# EAGLE design bot_uc_board (EAGLE 9.6.2)
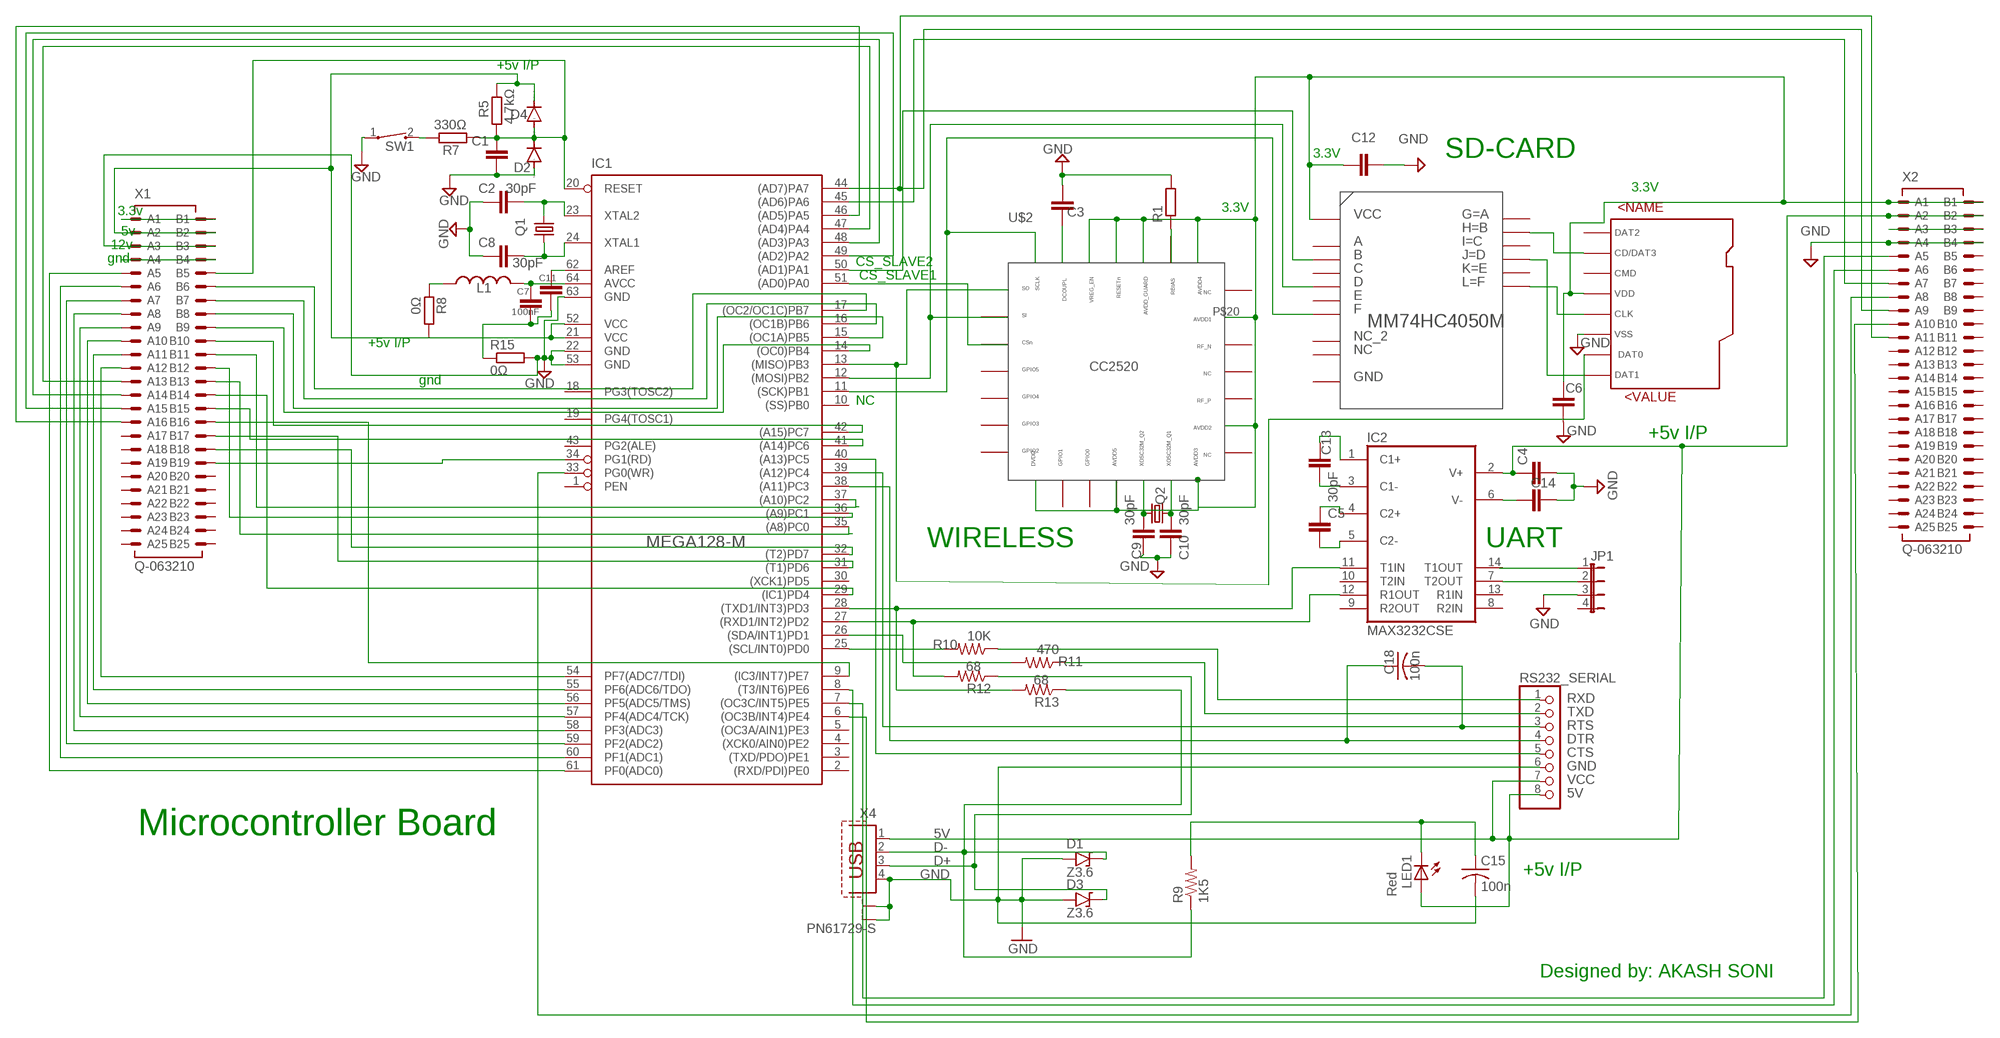
[diagram p0: schematic, sheet 1]

## Parts
C1  C-EU025-024X044  [C025-024X044]
C2  30pF  C-EU025-024X044  [C025-024X044]
C3  C-EU025-024X044  [C025-024X044]
C4  C-EU025-024X044  [C025-024X044]
C5  C-EU025-024X044  [C025-024X044]
C6  30pF  C-EU025-024X044  [C025-024X044]
C7  C-EU025-024X044  [C025-024X044]
C8  30pF  C-EU025-024X044  [C025-024X044]
C9  30pF  C-EU025-024X044  [C025-024X044]
C10  30pF  C-EU025-024X044  [C025-024X044]
C11  100nF  C-EU025-024X044  [C025-024X044]
C12  C-EU025-024X044  [C025-024X044]
C13  30pF  C-EU025-024X044  [C025-024X044]
C14  C-EU025-024X044  [C025-024X044]
C15  100n  C-US050-024X044  [C050-024X044]
C18  100n  C-US050-024X044  [C050-024X044]
D1  Z3.6  1N9ZENER  [DO35-3]
D2  1N4004  [DO41-10]
D3  Z3.6  1N9ZENER  [DO35-3]
D4  1N4004  [DO41-10]
IC1  MEGA128-M  [MLF64]
IC2  MAX3232CSE  [SO16]
JP1  JP4E  [JP4]
L1  L-US0204/5  [0204/5]
LED1  Red  LED3MM  [LED3MM]
Q1  CRYSTALHC49U-V  [HC49U-V]
Q2  CRYSTALHC49U-V  [HC49U-V]
R1  R-EU_0204/2V  [0204V]
R5  4.7kΩ  R-EU_0204/2V  [0204V]
R7  330Ω  R-EU_0204/2V  [0204V]
R8  0Ω  R-EU_0204/2V  [0204V]
R9  1K5  R-US_0207/7  [0207/7]
R10  10K  R-US_0207/7  [0207/7]
R11  470  R-US_0207/7  [0207/7]
R12  68  R-US_0207/7  [0207/7]
R13  68  R-US_0207/7  [0207/7]
R15  0Ω  R-EU_0204/2V  [0204V]
RS232_SERIAL  PINHD-1X8/90  [1X08/90]
SW1  CT10-XXXX-A2  [CT10-XXXX-A2]
U$1  74HC4050  [74HC405]
U$2  CC2520  [CC2520_FOOT]
U$3  SDCARD  [SDCARD_FOOT]
X1  Q-063210  [063210]
X2  Q-063210  [063210]
X4  PN61729-S  [PN61729-S]

## Nets
3.3V_VCC: D4.C IC1.21(VCC) IC1.52(VCC) R5.2 R8.2
D+: D3.C R12.1 X4.3
D-: D1.C R9.1 R13.1 X4.2
GND: C1.1 C2.1 C3.1 C4.2 C6.1 C8.1 C9.1 C10.1 C12.2 C14.2 C15.2 D1.A D2.A D3.A IC1.22(GND) IC1.53(GND) IC1.63(GND) JP1.3 R1.2 R15.2 RS232_SERIAL.6 SW1.1 U$3.P$6(VSS) X1.A3 X1.B3 X2.A4 X2.B4 X4.4 X4.S1 X4.S2
N$1: D2.C D4.A IC1.20(RESET) R5.1 R7.1 X1.B5
N$2: IC1.12((MOSI)PB2) U$1.P$9(D) U$2.P$2
N$3: C7.1 IC1.64(AVCC) L1.1
N$4: L1.2 R8.1
N$5: IC1.51((AD0)PA0) U$2.P$3
N$6: R7.2 SW1.2
N$7: IC1.13((MISO)PB3) U$2.P$1 U$3.P$7(DAT0)
N$8: C2.2 IC1.23(XTAL2) Q1.2
N$9: C8.2 IC1.24(XTAL1) Q1.1
N$10: C9.2 Q2.2 U$2.P$12
N$11: C10.2 Q2.1 U$2.P$13
N$12: IC1.11((SCK)PB1) U$1.P$14(F) U$2.P$28
N$13: C11.2 IC1.62(AREF)
N$14: C7.2 C11.1 R15.1
N$15: R1.1 U$2.P$23
N$16: C3.2 U$2.P$27
N$17: U$1.P$4(H) U$3.P$2(CD/DAT3)
N$18: C6.2 C12.1 U$1.P$1(VCC) U$2.P$8 U$2.P$11 U$2.P$14 U$2.P$16 U$2.P$20 U$2.P$22 U$2.P$24 U$2.P$25 U$2.P$26 U$3.P$4(VDD) X2.A1 X2.B1
N$19: U$1.P$10(J) U$3.P$8(DAT1)
N$20: U$1.P$15(L) U$3.P$5(CLK)
N$21: IC1.50((AD1)PA1) U$1.P$5(B)
N$22: X1.A2 X1.B2
N$23: C4.1 IC2.2(V+) LED1.A RS232_SERIAL.7 RS232_SERIAL.8 X2.A2 X2.B2 X4.1
N$24: C14.1 IC2.6(V-)
N$25: C5.1 IC2.4(C2+)
N$26: C13.1 IC2.1(C1+)
N$27: C5.2 IC2.5(C2-)
N$28: C13.2 IC2.3(C1-)
N$29: IC2.14(T1OUT) JP1.1
N$30: IC2.7(T2OUT) JP1.2
N$31: C15.1 LED1.K(C) R9.2
N$32: IC1.61(PF0(ADC0)) X1.A5
N$33: IC1.60(PF1(ADC1)) X1.A6
N$34: C18.1 IC1.38((A11)PC3) RS232_SERIAL.4
N$35: C18.2 IC1.39((A12)PC4) RS232_SERIAL.3
N$36: IC1.40((A13)PC5) RS232_SERIAL.5
N$37: IC1.25((SCL/INT0)PD0) R10.2
N$38: IC1.26((SDA/INT1)PD1) R11.2
N$39: IC1.27((RXD1/INT2)PD2) IC2.12(R1OUT) R12.2
N$40: IC1.28((TXD1/INT3)PD3) IC2.11(T1IN) R13.2
N$41: IC1.59(PF2(ADC2)) X1.A7
N$42: IC1.58(PF3(ADC3)) X1.A8
N$43: IC1.57(PF4(ADC4/TCK)) X1.A9
N$44: IC1.56(PF5(ADC5/TMS)) X1.A10
N$45: IC1.55(PF6(ADC6/TDO)) X1.A11
N$46: IC1.54(PF7(ADC7/TDI)) X1.A12
N$47: IC1.47((AD4)PA4) X1.A13
N$48: IC1.48((AD3)PA3) X1.A14
N$49: IC1.49((AD2)PA2) X1.A15
N$50: IC1.46((AD5)PA5) X1.A16
N$51: X1.A1 X1.B1
N$52: X1.A4 X1.B4
N$53: IC1.31((T1)PD6) X1.B17
N$54: IC1.32((T2)PD7) X1.B18
N$55: IC1.34(PG1(RD)) X1.B19
N$56: IC1.9((IC3/INT7)PE7) X1.B16
N$57: IC1.17((OC2/OC1C)PB7) X1.B6
N$58: IC1.16((OC1B)PB6) X1.B7
N$59: IC1.15((OC1A)PB5) X1.B8
N$60: IC1.14((OC0)PB4) X1.B9
N$61: IC1.42((A15)PC7) X1.B10
N$62: IC1.41((A14)PC6) X1.B15
N$63: IC1.37((A10)PC2) X1.B11
N$64: IC1.36((A9)PC1) X1.B12
N$65: IC1.35((A8)PC0) X1.B13
N$66: IC1.29((IC1)PD4) X1.B14
N$67: X2.A3 X2.B3
N$68: IC1.7((OC3C/INT5)PE5) X2.A5
N$69: IC1.8((T3/INT6)PE6) X2.A6
N$70: IC1.45((AD6)PA6) X2.A7
N$71: IC1.33(PG0(WR)) X2.A8
N$72: IC1.44((AD7)PA7) X2.A9 X2.A11
N$73: IC1.6((OC3B/INT4)PE4) X2.A10
RXD: R10.1 RS232_SERIAL.1
TXD: R11.1 RS232_SERIAL.2
Unconnected: C1.2 IC1.1(PEN) IC1.2((RXD/PDI)PE0) IC1.3((TXD/PDO)PE1) IC1.4((XCK0/AIN0)PE2) IC1.5((OC3A/AIN1)PE3) IC1.10((SS)PB0) IC1.18(PG3(TOSC2)) IC1.19(PG4(TOSC1)) IC1.30((XCK1)PD5) IC1.43(PG2(ALE)) IC2.8(R2IN) IC2.9(R2OUT) IC2.10(T2IN) IC2.13(R1IN) JP1.4 U$1.P$2(G) U$1.P$3(A) U$1.P$6(I) U$1.P$7(C) U$1.P$8(GND) U$1.P$11(E) U$1.P$12(K) U$1.P$13(NC_2) U$1.P$16(NC) U$2.P$4 U$2.P$5 U$2.P$6 U$2.P$7 U$2.P$9 U$2.P$10 U$2.P$15 U$2.P$17 U$2.P$18 U$2.P$19 U$2.P$21 U$3.P$1(DAT2) U$3.P$3(CMD) X1.A17 X1.A18 X1.A19 X1.A20 X1.A21 X1.A22 X1.A23 X1.A24 X1.A25 X1.B20 X1.B21 X1.B22 X1.B23 X1.B24 X1.B25 X2.A12 X2.A13 X2.A14 X2.A15 X2.A16 X2.A17 X2.A18 X2.A19 X2.A20 X2.A21 X2.A22 X2.A23 X2.A24 X2.A25 X2.B5 X2.B6 X2.B7 X2.B8 X2.B9 X2.B10 X2.B11 X2.B12 X2.B13 X2.B14 X2.B15 X2.B16 X2.B17 X2.B18 X2.B19 X2.B20 X2.B21 X2.B22 X2.B23 X2.B24 X2.B25

## Notes on the sheet
- +5v I/P
- 3.3V | SD-CARD
- 3.3V
- 3.3v | 3.3V
- 5v
- 12v
- gnd | CS_SLAVE2
- CS_SLAVE1
- +5v I/P
- gnd
- NC
- +5v I/P
- WIRELESS | UART
- RXD
- TXD
- RTS
- DTR
- CTS
- GND
- VCC
- 5V
- Microcontroller Board | 5V
- +5v I/P
- Designed by: AKASH SONI

## Power pins joined to a net without a drawn wire
3.3V_VCC: IC2.16(VCC)
GND: IC2.15(GND)

## Library data of the parts
C1-C14 = rcl:C-EU: CAPACITOR, European symbol; SPICEPREFIX: C
C15 C18 = adafruit:C-US: CAPACITOR, American symbol
D1 D3 = gm-diodes:1N9*ZENER: 1N9???B Zener Diode DO-35 case 1N957B - 1N992B (6.8V to 200V)
D2 D4 = diode:1N4004: DIODE general purpose rectifier, 1 A
IC1 = atmel:MEGA128: MICROCONTROLLER 128 Kbytes FLASH 4 Kbytes SRAM 4 Kbytes EEPROM DUAL USART 8-channel 10 bit ADC Source: avr.lbr; MPN: ATMEGA128-16MU; OC_FARNELL: 1455093; OC_NEWARK: 58M3717
IC2 = maxim:MAX3232*: True RS-232 Transceivers 3.0V to 5.5V, Low-Power up to 1Mbps, Using Four 0.1µF External Capacitors Source: http://pdfserv.maxim-ic.com/en/ds/MAX3222-MAX3241.pdf; MPN: MAX3232CSE; OC_FARNELL: 9725490; OC_NEWARK: 90C2890
JP1 = jumper:JP4E: JUMPER
L1 = rcl:L-US: INDUCTOR, American symbol; SPICEPREFIX: L
LED1 = adafruit:LED: LED OSRAM: - CHIPLED LG R971, LG N971, LY N971, LG Q971, LY Q971, LO R971, LY R971 LH N974, LH R974 LS Q976, LO Q976, LY Q976 LO Q996 - Hyper CHIPLED LW Q18S LB Q993, LB Q99A, LB R99A - SideLED LS A670, LO A670, LY A670, LG A670, LP A670 LB A673, LV A673, LT A673, LW A673 LH A674 LY A675 LS A676, LA A676, LO A676, LY A676, LW A676 LS A679, LY A679, LG A679 - Hyper Micro SIDELED® LS Y876, LA Y876, LO Y876, LY Y876 LT Y87S - SmartLED LW L88C, LW L88S LB L89C, LB L89S, LG L890 LS L89K, LO L89K, LY L89K LS L896, LA L896, LO L896, LY L896 - TOPLED LS T670, LO T670, LY T670, LG T670, LP T670 LSG T670, LSP T670, LSY T670, LOP T670, LYG T670 LG T671, LOG T671, LSG T671 LB T673, LV T673, LT T673, LW T673 LH T674 LS T676, LA T676, LO T676, LY T676, LB T676, LH T676, LSB T676, LW T676 LB T67C, LV T67C, LT T67C, LS T67K, LO T67K, LY T67K, LW E67C LS E67B, LA E67B, LO E67B, LY E67B, LB E67C, LV E67C, LT E67C LW T67C LS T679, LY T679, LG T679 LS T770, LO T770, LY T770, LG T770, LP T770 LB T773, LV T773, LT T773, LW T773 LH T774 LS E675, LA E675, LY E675, LS T675 LS T776, LA T776, LO T776, LY T776, LB T776 LHGB T686 LT T68C, LB T68C - Hyper Mini TOPLED® LB M676 - Mini TOPLED Santana® LG M470 LS M47K, LO M47K, LY M47K Source: http://www.osram.convergy.de/
Q1 Q2 = crystal:CRYSTAL: CRYSTAL; OC_FARNELL: 1666969; OC_NEWARK: unknown
R1 R5 R7 R8 R15 = rcl:R-EU_: RESISTOR, European symbol; SPICEPREFIX: R
R9-R13 = adafruit:R-US_: RESISTOR, American symbol
RS232_SERIAL = pinhead:PINHD-1X8: PIN HEADER
SW1 = switch-coto:CT10-XXXX-: CT10 Series Molded Switch Source: www.cotorelay.com .. Coto_Technology__CT10-1530-G1.pdf
U$1 = 74HC4050:74HC4050
U$2 = CC2520_wireless_module:CC2520
U$3 = SDCard:SDCARD
X1 X2 = con-erni:Q-063210: Male Connector SMC-Q 50 contacts Standard Assembly Height Source: http://www.erni.com/DB/PDF-Drawing/SMC/063210.pdf; OC_FARNELL: unknown; OC_NEWARK: unknown
X4 = con-berg:PN61729-S: BERG USB connector; OC_FARNELL: unknown; OC_NEWARK: unknown

## Board
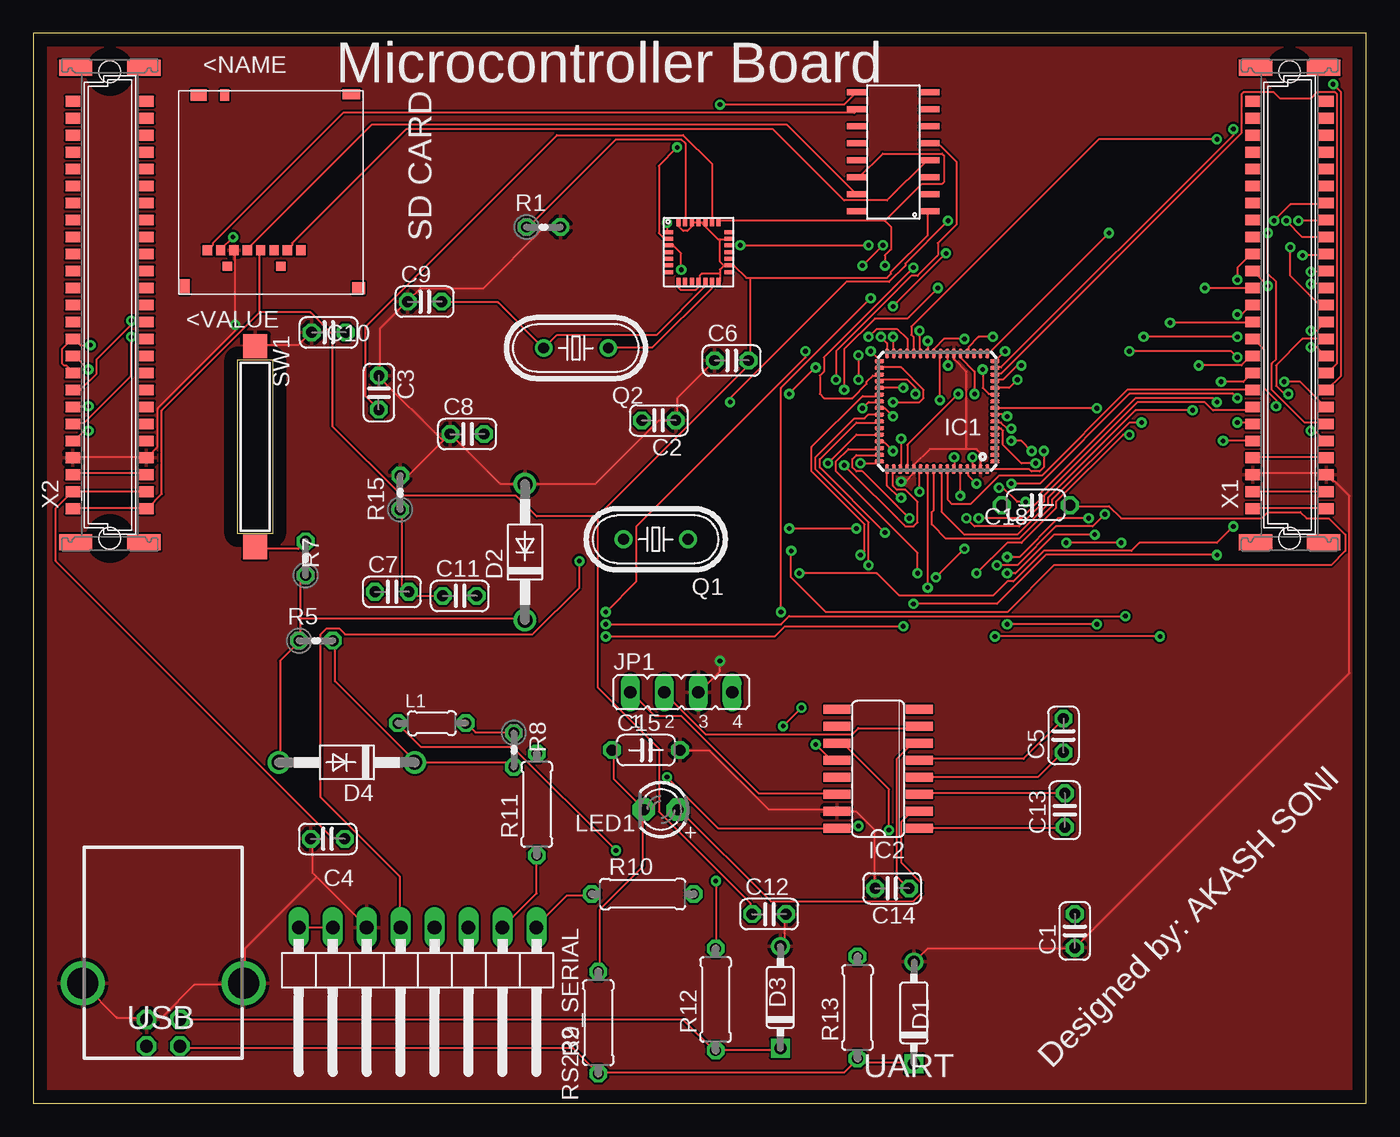
[diagram p1: board, top side]
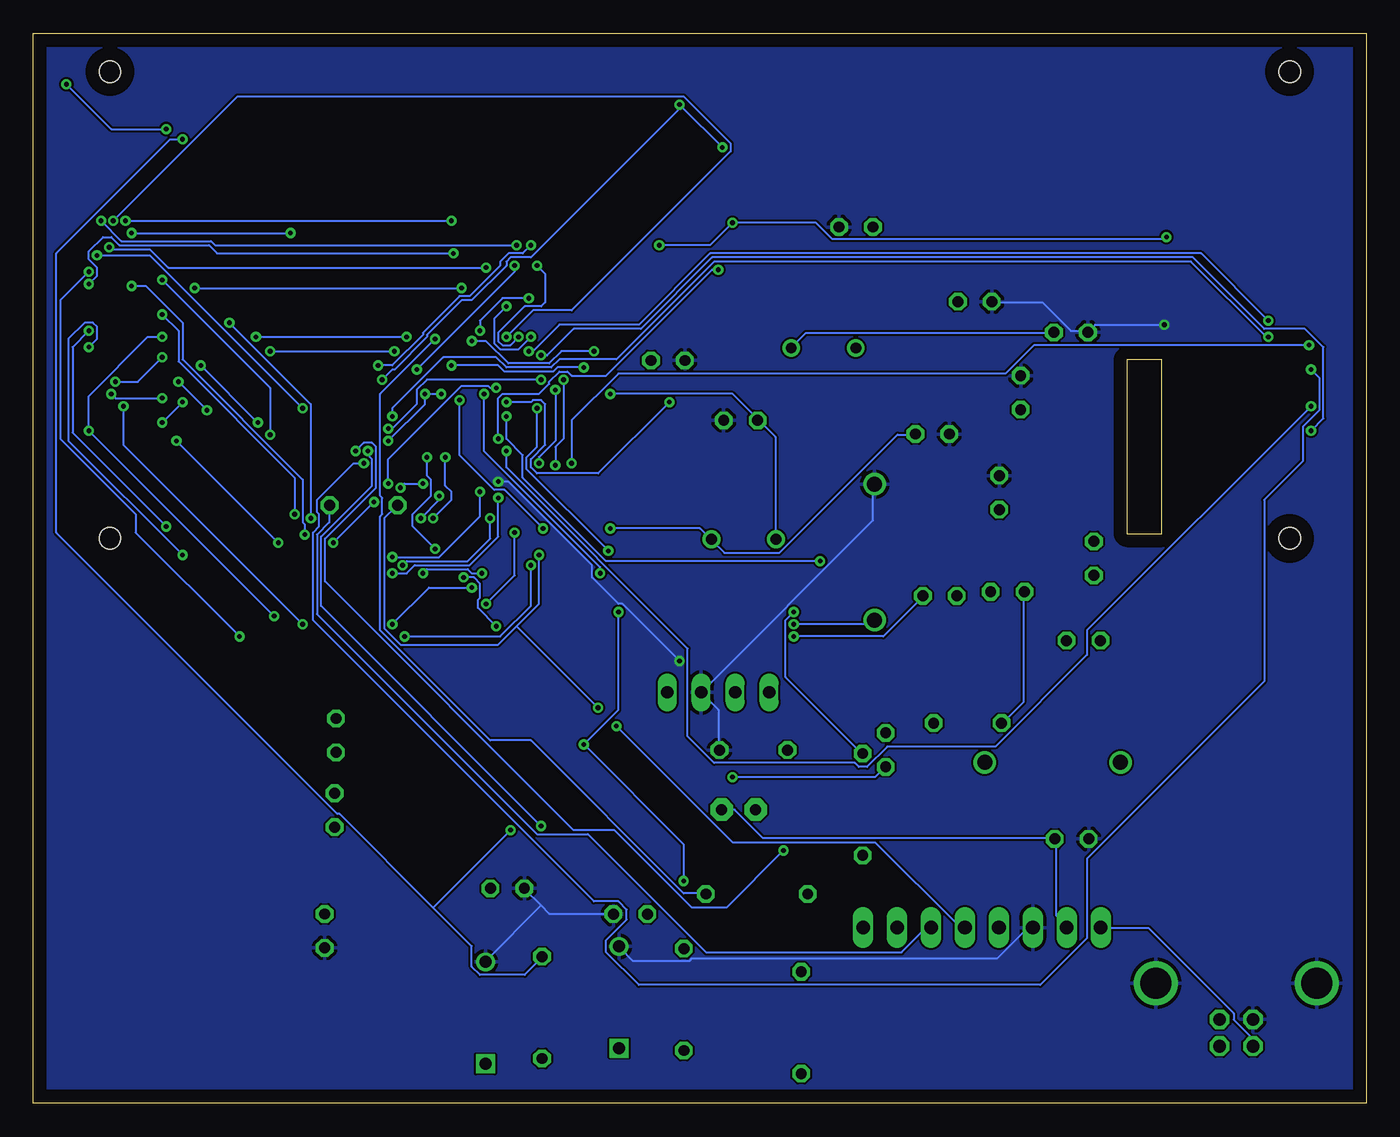
[diagram p2: board, bottom side, seen from below]

Size 99.7 x 80 mm. Coordinates in mm from the lower left corner, seen from the top.
Outline: 0,0 99.7,0 99.7,80 0,80 0,0
Copper layers (1*16): Top 0.035mm / dielectric 1.5mm / Bottom 0.035mm
Design rules "default": minimum track width 6mil, minimum drill 0.35mm, track to track 6mil, track to pad 6mil, pad to pad 6mil, via to via 6mil, smd to smd 6mil, copper to edge 40mil, drill to drill 6mil, minimum pad ring 10mil, minimum via ring 8mil, stop-mask expansion 4mil, vias tented up to drill 0mil, thermal gap 10mil

### Footprints (pad centres in the part's own frame; a part is rotated, then mirrored left to right if it is on the bottom)
C025-024X044 = drill 0.813 octagon: 1 -1.27,0; 2 1.27,0
C050-024X044 = drill 0.813 octagon: 1 -2.54,0; 2 2.54,0
DO35-3 = drill 0.9: A 3.81,0 | drill 0.9 square: C -3.81,0
DO41-10 = drill 1.118: A 5.08,0; C -5.08,0
MLF64 = smd 0.7 x 0.3: 1 -4.325,3.75; 2 -4.325,3.25; 3 -4.325,2.75; 4 -4.325,2.25; 5 -4.325,1.75; 6 -4.325,1.25; 7 -4.325,0.75; 8 -4.325,0.25; 9 -4.325,-0.25; 10 -4.325,-0.75; 11 -4.325,-1.25; 12 -4.325,-1.75; 13 -4.325,-2.25; 14 -4.325,-2.75; 15 -4.325,-3.25; 16 -4.325,-3.75; 33 4.325,-3.75; 34 4.325,-3.25; 35 4.325,-2.75; 36 4.325,-2.25; 37 4.325,-1.75; 38 4.325,-1.25; 39 4.325,-0.75; 40 4.325,-0.25; 41 4.325,0.25; 42 4.325,0.75; 43 4.325,1.25; 44 4.325,1.75; 45 4.325,2.25; 46 4.325,2.75; 47 4.325,3.25; 48 4.325,3.75 | smd 0.3 x 0.7: 17 -3.75,-4.325; 18 -3.25,-4.325; 19 -2.75,-4.325; 20 -2.25,-4.325; 21 -1.75,-4.325; 22 -1.25,-4.325; 23 -0.75,-4.325; 24 -0.25,-4.325; 25 0.25,-4.325; 26 0.75,-4.325; 27 1.25,-4.325; 28 1.75,-4.325; 29 2.25,-4.325; 30 2.75,-4.325; 31 3.25,-4.325; 32 3.75,-4.325; 49 3.75,4.325; 50 3.25,4.325; 51 2.75,4.325; 52 2.25,4.325; 53 1.75,4.325; 54 1.25,4.325; 55 0.75,4.325; 56 0.25,4.325; 57 -0.25,4.325; 58 -0.75,4.325; 59 -1.25,4.325; 60 -1.75,4.325; 61 -2.25,4.325; 62 -2.75,4.325; 63 -3.25,4.325; 64 -3.75,4.325
SO16 = smd 0.66 x 2.032: 1 -4.445,-3.073; 2 -3.175,-3.073; 3 -1.905,-3.073; 4 -0.635,-3.073; 5 0.635,-3.073; 6 1.905,-3.073; 7 3.175,-3.073; 8 4.445,-3.073; 9 4.445,3.073; 10 3.175,3.073; 11 1.905,3.073; 12 0.635,3.073; 13 -0.635,3.073; 14 -1.905,3.073; 15 -3.175,3.073; 16 -4.445,3.073
JP4 = drill 0.914 long: 1 -3.81,0; 2 -1.27,0; 3 1.27,0; 4 3.81,0
0204/5 = drill 0.813 octagon: 1 -2.54,0; 2 2.54,0
LED3MM = drill 0.813 pad 1.676 octagon: A -1.27,0; K 1.27,0
HC49U-V = drill 0.813: 1 -2.413,0; 2 2.413,0
0204V = drill 0.813 octagon: 1 -1.27,0; 2 1.27,0
0207/7 = drill 0.813 octagon: 1 -3.81,0; 2 3.81,0
1X08/90 = drill 1.016 long: 1 -8.89,-3.81; 2 -6.35,-3.81; 3 -3.81,-3.81; 4 -1.27,-3.81; 5 1.27,-3.81; 6 3.81,-3.81; 7 6.35,-3.81; 8 8.89,-3.81
CT10-XXXX-A2 = smd 1.8 x 1.8: 1 -7.5,0; 2 7.5,0
74HC405 = smd 1.5 x 0.45: P$1 -0.75,9.44; P$2 -0.75,8.17; P$3 -0.75,6.9; P$4 -0.75,5.63; P$5 -0.75,4.36; P$6 -0.75,3.09; P$7 -0.75,1.82; P$8 -0.75,0.55; P$9 4.65,0.55; P$10 4.65,1.82; P$11 4.65,3.09; P$12 4.65,4.36; P$13 4.65,5.63; P$14 4.65,6.9; P$15 4.65,8.17; P$16 4.65,9.44
CC2520_FOOT = smd 0.65 x 0.3: P$1 0.325,4.075; P$2 0.325,3.575; P$3 0.325,3.075; P$4 0.325,2.575; P$5 0.325,2.075; P$6 0.325,1.575; P$7 0.325,1.075; P$15 4.825,1.075; P$16 4.825,1.575; P$17 4.825,2.075; P$18 4.825,2.575; P$19 4.825,3.075; P$20 4.825,3.575; P$21 4.825,4.075 | smd 0.3 x 0.65: P$8 1.075,0.325; P$9 1.575,0.325; P$10 2.075,0.325; P$11 2.575,0.325; P$12 3.075,0.325; P$13 3.575,0.325; P$14 4.075,0.325; P$22 1.075,4.825; P$23 1.575,4.825; P$24 2.075,4.825; P$25 2.575,4.825; P$26 3.075,4.825; P$27 3.575,4.825; P$28 4.075,4.825
SDCARD_FOOT = smd 0.7 x 0.65: GND 0.725,2.075; GND1 -3.275,2.075 | smd 0.7 x 0.75: P$1 2.225,3.275; P$2 1.225,3.275; P$3 0.225,3.275; P$4 -0.775,3.275; P$5 -1.775,3.275; P$6 -2.775,3.275; P$7 -3.775,3.275; P$8 -4.775,3.275 | smd 0.95 x 0.9: P$11 6.55,0.45 | smd 0.745 x 1.1: P$12 -6.46,0.55 | smd 0.65 x 0.85: P$13 -3.475,14.875 | smd 1.3 x 0.75: P$14 6.013,14.925 | smd 1.2 x 0.85: P$16 -5.412,14.875
063210 = smd 0.8 x 1.1: A1 -15.24,2.765; A2 -13.97,2.765; A3 -12.7,2.765; A4 -11.43,2.765; A5 -10.16,2.765; A6 -8.89,2.765; A7 -7.62,2.765; A8 -6.35,2.765; A9 -5.08,2.765; A10 -3.81,2.765; A11 -2.54,2.765; A12 -1.27,2.765; A13 0,2.765; A14 1.27,2.765; A15 2.54,2.765; A16 3.81,2.765; A17 5.08,2.765; A18 6.35,2.765; A19 7.62,2.765; A20 8.89,2.765; A21 10.16,2.765; A22 11.43,2.765; A23 12.7,2.765; A24 13.97,2.765; A25 15.24,2.765; B1 -15.24,-2.74; B2 -13.97,-2.74; B3 -12.7,-2.74; B4 -11.43,-2.74; B5 -10.16,-2.74; B6 -8.89,-2.74; B7 -7.62,-2.74; B8 -6.35,-2.74; B9 -5.08,-2.74; B10 -3.81,-2.74; B11 -2.54,-2.74; B12 -1.27,-2.74; B13 0,-2.74; B14 1.27,-2.74; B15 2.54,-2.74; B16 3.81,-2.74; B17 5.08,-2.74; B18 6.35,-2.74; B19 7.62,-2.74; B20 8.89,-2.74; B21 10.16,-2.74; B22 11.43,-2.74; B23 12.7,-2.74; B24 13.97,-2.74; B25 15.24,-2.74 | smd 1.2 x 2.5: M1 -17.745,2.55; M2 -17.745,-2.55; M3 17.745,-2.55; M4 17.745,2.55 | hole 1.6: -17.45,0; 17.45,0
PN61729-S = drill 0.95 octagon: 1 1.25,4.71; 2 -1.25,4.71; 3 -1.25,2.71; 4 1.25,2.71 | drill 2.3 pad 2.9: S1 -6.02,0; S2 6.02,0

### Placement (x,y rotation side)
C1  77.91,12.88 90 top
C2  46.79,51.06 180 top
C3  25.84,53.14 270 top
C4  22.02,19.76 180 top
C5  77.06,27.5 90 top
C6  52.23,55.54 0 top
C7  26.82,38.24 0 top
C8  32.45,50.04 0 top
C9  29.27,59.94 0 top
C10  22.09,57.64 0 top
C11  31.89,37.94 0 top
C12  55.04,14.14 0 top
C13  77.16,21.91 90 top
C14  64.24,16.06 180 top
C15  45.83,26.4 0 top
C18  75,44.72 0 top
D1  65.88,6.75 90 top
D2  36.77,41.21 90 top
D3  55.88,7.91 90 top
D4  23.45,25.48 180 top
IC1  67.61,51.74 180 top
IC2  63.2,25.01 90 top
JP1  48.47,30.72 0 top
L1  29.81,28.42 0 top
LED1  46.94,21.95 180 top
Q1  46.56,42.17 180 top
Q2  40.59,56.47 180 top
R1  38.16,65.52 0 top
R5  21.14,34.59 0 top
R7  20.36,40.74 90 top
R8  35.94,26.42 270 top
R9  42.26,6.02 90 top
R10  45.58,15.64 0 top
R11  37.66,22.34 90 top
R12  51.04,7.75 90 top
R13  61.65,7.15 90 top
R15  27.44,45.66 90 top
RS232_SERIAL  28.74,9.32 180 top
SW1  16.59,49.09 270 top
U$1  66.28,76.14 180 top
U$2  47.19,61.07 0 top
U$3  17.78,60.51 0 top
X1  93.98,59.69 90 top
X2  5.71,59.69 90 top
X4  9.71,8.97 180 top

### Tracks (layer width: path | path; a pad name or v marks a point on that pad's centre or on a via)
3.3V_VCC  (via drill 0.35)
  Top 0.152: R5.2 22.55,34.44 22.55,31.55 28.5,25.6 D4.C 28.65,25.45 35.66,25.45 35.81,25.3 R8.2 | v69.19,53.03 65.38,49.23 65.38,47.55 IC1.52 | v70.41,53.03 70.41,54.71 69.34,55.78 69.34,55.93 IC1.21 | v47.4,24.38 51.21,20.57 60.05,20.57 IC2.16 60.2,20.57 60.35,20.73 v61.72,20.73 | v73.15,49.53 73.91,49.53 v74.68,48.77
  Bottom 0.152: v69.19,53.03 v70.41,53.03 70.41,52.27 v73.15,49.53 | v47.4,24.38 36.73,24.38 35.97,25.15 R8.2 | v74.68,48.77 74.68,48.46 74.37,48.16 74.37,46.18 78.18,42.37 78.18,37.19 v61.72,20.73
D+
  Top 0.152: D3.C 55.78,3.96 51.05,3.96 R12.1 50.9,3.96 48.62,6.25 10.97,6.25 X4.3
D-
  Top 0.152: D1.C 65.84,3.05 61.87,3.05 61.72,3.2 R13.1 61.57,3.2 60.66,2.29 42.37,2.29 R9.1 42.22,2.29 40.39,4.12 10.97,4.12 X4.2
GND  (via drill 0.35)
  Top 0.152: C6.1 50.9,55.47 48.16,52.73 48.16,51.21 C2.1 48.01,51.05 46.79,51.05 42.06,46.33 36.88,46.33 D2.A 36.73,46.33 34.9,46.33 31.24,49.99 C8.1 31.09,49.99 30.63,49.53 | 30.63,49.53 28.04,46.94 27.58,46.94 R15.2 | U$3.P$6 15.09,63.7 v15.09,58.22 15.09,57.76 9.3,51.97 9.3,49.07 8.53,48.31 X2.B4 8.38,48.31 3.05,48.31 X2.A4 | SW1.1 16.61,56.69 19.81,56.69 20.73,57.61 C10.1 | R1.2 39.32,65.38 38.1,65.38 33.68,60.96 28.96,60.96 28.04,60.05 C9.1 27.89,59.89 25.91,57.91 25.91,54.56 C3.1 25.76,54.41 30.63,49.53 | X1.A3 91.29,47.09 96.62,47.09 X1.B3 96.77,46.94 97.23,46.48 97.38,46.48 98.45,45.41 98.45,32.16 78.03,11.73 C1.1 77.88,11.58 66.9,11.58 65.99,10.67 D1.A | X4.S2 3.81,8.84 6.25,6.4 8.38,6.4 X4.4 8.53,6.4 9.6,6.4 12.04,8.84 15.7,8.84 X4.S1 15.85,8.99 15.85,11.58 21.18,16.92 | 21.18,16.92 24.84,13.26 RS232_SERIAL.6 | 21.18,16.92 20.88,17.22 20.88,19.66 C4.2 | 69.8,48.92 70.56,48.92 70.87,48.62 70.87,47.55 IC1.63 | 69.8,48.92 67.06,48.92 65.84,47.7 65.84,47.55 IC1.53 65.84,47.4 65.84,47.09 65.23,46.48 v64.92,46.48 | 69.8,48.92 69.8,54.71 68.89,55.63 68.89,55.93 IC1.22 | C12.2 56.24,14.02 56.24,12.04 55.93,11.73 D3.A | C14.2 62.94,16.15 62.94,20.42 61.57,21.79 60.2,21.79 IC2.15 60.05,21.95 55.02,21.95 50.6,26.36 48.46,26.36 C15.2 | v51.36,33.07 51.36,32.31 49.84,30.79 JP1.3
  Bottom 0.152: C9.1 27.89,59.89 24.23,59.89 22.1,57.76 20.88,57.76 C10.1 20.73,57.76 20.27,58.22 v15.09,58.22 | C15.2 48.46,26.52 48.46,29.41 49.68,30.63 JP1.3 49.68,30.79 36.88,43.59 36.88,46.18 D2.A | 61.72,14.78 62.94,16 C14.2 | 61.72,14.78 61.11,14.17 56.39,14.17 C12.2 | v64.92,46.48 64.16,46.48 57.91,40.23 57.91,39.32 55.93,37.34 55.63,37.34 v51.36,33.07 | RS232_SERIAL.6 24.99,13.11 25.3,13.11 27.58,10.82 50.44,10.82 50.6,10.67 54.86,10.67 55.78,11.58 D3.A | 61.72,14.78 65.84,10.67 D1.A
  pour Top: -0.64,80.64 -0.64,-0.64 100.33,-0.64 100.33,80.64
  pour Bottom: -1.27,81.28 -1.27,-1.27 100.97,-1.27 100.97,81.28
N$1  (via drill 0.35)
  Top 0.152: v71.78,57.3 70.71,57.3 69.95,56.54 69.95,56.08 IC1.20 | v90.07,57.3 v83.06,57.3 | v95.56,50.29 95.86,50.29 96.62,49.53 X1.B5 | 19.96,36.27 19.96,39.01 20.27,39.32 R7.1 | 19.96,36.27 19.96,34.59 R5.1 19.81,34.44 18.44,33.07 18.44,25.6 D4.A | 19.96,36.27 36.73,36.27 D2.C | v81.69,36.42 56.54,36.42 55.93,35.81 v42.82,35.81
  Bottom 0.152: v83.06,57.3 v71.78,57.3 | v90.07,57.3 91.14,57.3 95.56,52.88 v95.56,50.29 v81.69,36.42 | v42.82,35.81 37.19,35.81 36.88,36.12 D2.C
N$2  (via drill 0.35)
  Top 0.152: v48.16,71.48 46.79,70.1 46.79,65.08 47.24,64.62 47.4,64.62 U$2.P$2 | v51.36,74.68 60.66,74.68 61.57,75.59 U$1.P$9 | v73.61,54.1 73,53.49 72.08,53.49 IC1.12
  Bottom 0.152: 51.21,74.52 v48.16,71.48 | v73.61,54.1 72.85,54.86 72.69,54.86 70.26,57.3 70.26,57.45 67.67,60.05 66.9,60.05 64.31,62.64 64.31,62.94 64.01,63.25 62.48,63.25 51.21,74.52 | 51.21,74.52 v51.36,74.68
N$3  (via drill 0.35)
  Top 0.152: v75.59,48.77 75.59,47.55 75.29,47.24 74.68,47.24 74.52,47.4 71.48,47.4 IC1.64 | v43.59,18.9 35.81,26.67 28.96,26.67 27.28,28.35 L1.1
  Bottom 0.152: v75.59,48.77 74.98,49.38 74.37,49.38 74.07,49.07 74.07,46.02 77.88,42.22 77.88,39.01 59.28,20.42 56.24,20.42 50.44,14.63 47.85,14.63 v43.59,18.9 | C7.1 25.6,38.1 25.6,30.02 27.13,28.5 L1.1
N$4
  Top 0.152: R8.1 35.81,27.74 33.07,27.74 32.46,28.35 L1.2
N$5  (via drill 0.35)
  Top 0.152: v48.46,62.33 48.46,63.55 47.85,64.16 47.55,64.16 U$2.P$3 | v64.92,49.68 64.92,47.55 IC1.51
  Bottom 0.152: v48.46,62.33 48.92,62.33 56.84,54.41 59.44,54.41 59.74,54.71 60.35,54.71 61.11,53.95 61.11,53.8 61.87,53.03 64.62,53.03 64.92,52.73 v64.92,49.68
N$6
  Top 0.152: SW1.2 16.61,41.45 19.81,41.45 20.27,41.91 R7.2
N$7  (via drill 0.35)
  Top 0.152: v47.4,65.84 47.4,65.23 U$2.P$1 | v14.94,64.77 14.02,63.86 U$3.P$7 | v73.91,55.17 73.61,55.17 72.54,54.1 72.08,54.1 IC1.13 | v52.88,64.16 v62.48,64.16
  Bottom 0.152: v14.94,64.77 15.09,64.62 39.93,64.62 41.15,65.84 v47.4,65.84 49.07,64.16 v52.88,64.16 | v73.91,55.17 72.85,55.17 70.56,57.45 70.56,57.61 67.82,60.35 67.06,60.35 64.77,62.64 64.77,62.94 64.16,63.55 63.09,63.55 v62.48,64.16
N$8  (via drill 0.35)
  Top 0.152: v68.43,55.17 68.43,55.93 IC1.23 | v56.54,53.03 v58.52,55.02
  Bottom 0.152: v68.43,55.17 64.92,55.17 64.47,54.71 60.81,54.71 60.5,55.02 v58.52,55.02 | v56.54,53.03 47.4,53.03 45.57,51.21 C2.2 45.41,51.05 44.2,49.84 44.2,42.22 Q1.2
N$9  (via drill 0.35)
  Top 0.152: v67.82,52.58 67.82,55.93 IC1.24 | v56.54,42.98 v61.57,42.98
  Bottom 0.152: v67.82,52.58 67.82,48.46 65.23,45.87 64.47,45.87 v61.57,42.98 | v56.54,42.98 49.84,42.98 49.07,42.22 Q1.1 48.92,42.06 48.01,41.15 43.89,41.15 35.05,49.99 33.83,49.99 C8.2
N$10
  Top 0.152: U$2.P$12 50.29,61.27 50.29,61.11 46.63,57.45 39.17,57.45 38.25,56.54 Q2.2 38.1,56.54 34.75,59.89 30.63,59.89 C9.2
N$11
  Top 0.152: U$2.P$13 50.75,61.27 50.75,60.96 46.33,56.54 43.13,56.54 Q2.1
  Bottom 0.152: C10.2 23.47,57.61 41.91,57.61 42.98,56.54 Q2.1
N$12  (via drill 0.35)
  Top 0.152: 63.7,65.99 51.36,65.99 U$2.P$28 | 63.7,65.99 66.45,68.73 67.97,68.73 68.12,68.89 68.12,70.87 67.97,71.02 63.55,71.02 61.72,69.19 U$1.P$14 | v71.02,54.86 71.02,53.49 71.48,53.03 71.93,53.03 IC1.11 | v63.7,62.64 63.7,63.4 64.16,63.86 64.16,65.53 63.7,65.99
  Bottom 0.152: v71.02,54.86 63.7,62.18 v63.7,62.64
N$13  (via drill 0.35)
  Top 0.152: v70.26,48.31 70.26,47.55 IC1.62 | v67.51,39.32 v69.65,41.45 | v65.08,35.66 56.24,35.66 55.47,34.9 v42.82,34.9
  Bottom 0.152: v70.26,48.31 70.26,46.94 69.95,46.63 69.95,45.41 71.32,44.04 71.32,43.13 v69.65,41.45 | v67.51,39.32 66.75,39.32 66.29,38.86 66.29,37.8 66.45,37.64 66.45,37.03 v65.08,35.66 | v42.82,34.9 36.12,34.9 33.22,37.8 C11.2
N$14
  Top 0.152: C11.1 30.48,37.95 28.35,37.95 28.19,38.1 C7.2 28.04,38.25 27.58,38.71 27.58,44.35 R15.1
N$15
  Top 0.152: U$2.P$23 48.77,65.99 48.77,71.78 48.46,72.08 43.59,72.08 37.03,65.53 R1.1
N$16
  Top 0.152: U$2.P$27 50.75,65.99 50.75,70.26 48.62,72.39 39.17,72.39 24.84,58.06 24.84,52.88 25.76,51.97 C3.2
N$17
  Top 0.152: U$3.P$2 19.05,63.86 19.36,64.16 19.36,64.31 27.89,72.85 55.32,72.85 60.66,67.51 63.86,67.51 66.9,70.56 U$1.P$4
N$18
  Top 0.152: 16.92,59.13 16.92,63.7 U$3.P$4 | 16.92,59.13 9.6,51.82 9.6,45.57 8.53,44.5 X2.B1 8.38,44.5 3.05,44.5 X2.A1 | U$2.P$22 48.31,65.84 48.31,65.53 48.62,65.23 48.92,65.23 49.23,65.53 49.23,65.84 U$2.P$24 49.38,65.84 49.68,65.84 U$2.P$25 49.84,65.84 49.99,65.84 | 49.99,65.84 50.14,65.84 U$2.P$26 | 51.36,64.62 51.21,64.62 49.99,65.84 | 51.36,64.62 51.97,64.62 U$2.P$20 | U$2.P$8 48.31,61.27 48.31,60.96 48.46,60.81 49.53,60.81 49.68,60.96 49.68,61.27 U$2.P$11 49.84,61.42 49.84,61.87 49.99,62.03 51.36,62.03 | 51.36,62.03 51.36,62.33 51.66,62.64 | 51.36,62.03 51.36,61.42 U$2.P$14 | 51.66,62.64 51.97,62.64 U$2.P$16 52.12,62.64 52.43,62.64 53.34,61.72 53.65,61.72 | 53.65,61.72 63.86,61.72 64.16,62.03 64.16,62.18 66.9,64.92 66.9,66.6 U$1.P$1 | 51.36,64.62 51.36,62.94 51.66,62.64 | 42.22,43.89 42.22,31.09 46.79,26.52 46.79,21.79 53.65,14.94 53.65,14.17 C12.1 | 42.22,43.89 53.49,55.17 53.49,55.47 C6.2 53.65,55.63 53.65,61.72 | 16.92,59.13 20.73,59.13 22.4,57.45 22.4,50.6 27.58,45.41 36.12,45.41 37.64,43.89 42.22,43.89
N$19
  Top 0.152: U$3.P$8 13.11,63.86 13.41,64.16 13.41,64.31 23.16,74.07 61.42,74.07 61.57,74.22 U$1.P$10
N$20
  Top 0.152: U$3.P$5 16.15,63.86 16.15,64.01 25.3,73.15 56.39,73.15 61.57,67.97 U$1.P$15
N$21  (via drill 0.35)
  Top 0.152: v60.66,47.7 65.23,43.13 65.84,43.13 66.14,43.43 66.14,44.96 65.23,45.87 64.62,45.87 64.31,46.18 64.31,47.4 IC1.50 | v60.05,54.1 60.05,56.24 65.68,61.87 66.14,61.87 67.67,63.4 67.67,64.31 69.04,65.68 69.04,70.41 67.82,71.63 67.06,71.63 U$1.P$5
  Bottom 0.152: v60.66,47.7 60.66,49.07 60.05,49.68 v60.05,54.1
N$22
  Top 0.152: X1.B2 X1.A2
N$23
  Top 0.152: IC2.2 66.14,21.79 65.68,21.79 64.92,21.03 64.92,17.98 66.45,16.46 66.45,15.7 65.84,15.09 55.17,15.09 48.31,21.95 LED1.A | X2.B2 X2.A2 2.9,45.72 1.68,44.5 1.68,40.54 22.4,19.81 23.16,19.81 C4.1 | RS232_SERIAL.8 19.96,13.11 22.25,13.11 RS232_SERIAL.7
  Bottom 0.152: X4.1 8.53,4.27 8.53,4.88 9.91,6.25 9.91,6.71 16.31,13.11 19.81,13.11 RS232_SERIAL.8 | RS232_SERIAL.7 22.4,13.26 23.16,14.02 23.16,19.66 C4.1 23.32,19.81 45.11,19.81 47.24,21.95 48.16,21.95 LED1.A
N$24
  Top 0.152: IC2.6 66.14,26.82 65.68,26.82 64.62,25.76 64.62,16.92 65.38,16.15 C14.1
N$25
  Top 0.152: IC2.4 66.29,24.38 75.13,24.38 76.96,26.21 C5.1
N$26
  Top 0.152: IC2.1 66.29,20.57 77.11,20.57 C13.1
N$27
  Top 0.152: IC2.5 66.29,25.76 74.07,25.76 76.96,28.65 C5.2
N$28
  Top 0.152: IC2.3 66.29,23.16 77.11,23.16 C13.2
N$29
  Top 0.152: IC2.14 60.05,23.16 54.25,23.16 48.46,28.96 46.48,28.96 44.81,30.63 JP1.1
N$30
  Top 0.152: IC2.7 66.14,28.04 61.72,28.04 61.27,27.58 50.29,27.58 47.24,30.63 JP1.2
N$31
  Top 0.152: R9.2 42.37,9.91 42.37,14.48 45.57,17.68 45.57,21.95 LED1.K 45.57,22.1 43.43,24.23 43.43,26.36 C15.1
N$32  (via drill 0.35)
  Top 0.152: v70.56,46.33 69.95,46.94 69.95,47.4 IC1.61 | v72.24,46.02 72.54,46.02 73.61,44.96 v74.22,44.96 | v81.38,41.91 v77.27,41.91 | X1.A5 v89,49.53
  Bottom 0.152: v70.56,46.33 71.93,46.33 v72.24,46.02 | v77.27,41.91 v74.22,44.96 | v89,49.53 v81.38,41.91
N$33  (via drill 0.35)
  Top 0.152: v69.34,45.41 69.34,47.4 IC1.60 | v70.71,43.74 73.91,43.74 75.29,45.11 75.29,45.57 82.45,52.73 88.24,52.73 v88.54,52.43 | v90.07,50.9 91.14,50.9 X1.A6
  Bottom 0.152: v69.34,45.41 69.34,45.11 v70.71,43.74 | v90.07,50.9 v88.54,52.43
N$34  (via drill 0.35)
  Top 0.152: v61.87,41 62.18,41.3 62.18,43.28 58.22,47.24 58.22,49.07 62.03,52.88 63.25,52.88 IC1.38 | v57.45,29.57 v56.08,28.19
  Bottom 0.152: v61.87,41 61.87,37.34 63.55,35.66 | 63.55,35.66 64.92,34.29 72.24,34.29 73.46,35.51 73.46,43.74 72.54,44.65 C18.1 | v56.08,28.19 47.4,19.51 36.73,19.51 30.48,13.26 30.02,13.26 RS232_SERIAL.4 | 63.55,35.66 v57.45,29.57
N$35  (via drill 0.35)
  Top 0.152: v62.03,51.97 62.48,52.43 63.25,52.43 IC1.39 | v56.69,41.3 56.69,39.32 59.28,36.73 72.85,36.73 76.35,40.23 97.08,40.23 98.15,41.3 98.15,42.52 96.93,43.74 95.25,43.74 94.79,44.2 92.35,44.2 91.9,43.74 81.38,43.74 80.47,44.65 77.57,44.65 C18.2
  Bottom 0.152: v62.03,51.97 62.03,49.07 62.79,48.31 62.79,47.4 v56.69,41.3 | RS232_SERIAL.3 32.61,13.11 32.92,13.11 34.75,11.28 49.38,11.28 58.22,20.12 62.03,20.12 78.49,36.58 78.49,42.52 77.57,43.43 77.57,44.65 C18.2
N$36  (via drill 0.35)
  Top 0.152: v64.31,51.36 63.7,51.97 63.4,51.97 IC1.40 | v40.84,40.54 40.84,38.56 37.34,35.05 23.32,35.05 22.86,35.51 21.95,35.51 21.49,35.05 21.49,22.86 27.43,16.92 27.43,13.26 RS232_SERIAL.5
  Bottom 0.152: v64.31,51.36 64.31,49.68 63.09,48.46 63.09,46.79 56.84,40.54 v40.84,40.54
N$37  (via drill 0.35)
  Top 0.152: v69.65,57.15 68.12,57.15 67.36,56.39 67.36,56.08 IC1.25
  Bottom 0.152: v69.65,57.15 73.76,53.03 73.76,45.41 73.61,45.26 73.61,44.04 73.76,43.89 73.76,35.36 65.53,27.13 62.48,27.13 51.05,15.7 49.53,15.7 R10.2
N$38  (via drill 0.35)
  Top 0.152: v66.9,57 66.9,56.08 IC1.26 | v57.76,56.24 57.76,55.78 45.11,43.13 45.11,39.01 v42.82,36.73
  Bottom 0.152: v66.9,57 65.84,57 64.16,55.32 61.11,55.32 60.2,56.24 v57.76,56.24 | v42.82,36.73 43.43,36.12 43.43,31.85 37.8,26.21 R11.2
N$39  (via drill 0.35)
  Top 0.152: v66.29,57.76 66.29,56.08 IC1.27 | v62.64,60.2 55.93,53.49 v55.93,36.73 | v58.52,26.82 59.59,25.76 60.05,25.76 IC2.12 | v51.05,16.61 51.05,11.58 R12.2
  Bottom 0.152: v66.29,57.76 66.29,58.52 64.62,60.2 v62.64,60.2 | v55.93,36.73 55.93,29.41 v58.52,26.82 51.05,19.36 v51.05,16.61
N$40  (via drill 0.35)
  Top 0.152: v88.54,72.08 79.7,72.08 65.68,58.06 65.68,57.45 65.84,57.3 65.84,56.08 IC1.28 | v64.01,20.42 64.01,23.47 60.66,26.82 60.2,26.82 IC2.11
  Bottom 0.152: v88.54,72.08 89.46,72.08 97.99,63.55 97.99,42.67 76.96,21.64 76.81,21.64 69.8,14.63 | 69.8,14.63 66.9,11.73 66.9,10.21 66.29,9.6 62.94,9.6 61.72,10.82 R13.2 | 69.8,14.63 v64.01,20.42
N$41  (via drill 0.35)
  Top 0.152: v68.89,48.31 68.89,47.55 IC1.59 | v69.8,43.74 70.41,43.13 73.76,43.13 75.59,44.96 75.59,45.41 82.6,52.43 87.63,52.43 88.24,51.82 90.98,51.82 91.14,51.97 X1.A7
  Bottom 0.152: v68.89,48.31 68.89,46.18 68.43,45.72 68.43,45.11 v69.8,43.74
N$42
  Top 0.152: X1.A8 81.84,53.34 75.44,46.94 72.24,46.94 70.1,44.81 68.73,44.81 68.43,45.11 68.43,47.4 IC1.58
N$43  (via drill 0.35)
  Top 0.152: v86.72,51.82 82.45,51.82 75.89,45.26 75.89,44.81 73.61,42.52 69.65,42.52 67.97,44.2 67.97,47.4 IC1.57 | v88.85,53.95 90.53,53.95 91.14,54.56 X1.A9
  Bottom 0.152: v88.85,53.95 v86.72,51.82
N$44  (via drill 0.35)
  Top 0.152: v82.91,50.9 81.99,50.9 76.2,45.11 76.2,44.65 73.76,42.22 68.28,42.22 67.21,43.28 67.21,44.2 67.36,44.35 67.36,47.4 IC1.56 | v87.17,55.17 90.37,55.17 91.14,55.93 X1.A10
  Bottom 0.152: v87.17,55.17 v82.91,50.9
N$45  (via drill 0.35)
  Top 0.152: v66.9,38.56 66.9,47.4 IC1.55 | v79.55,35.81 v72.85,35.81 | v92.96,52.12 92.96,52.58 92.05,53.49 92.05,56.39 91.29,57.15 X1.A11
  Bottom 0.152: v66.9,38.56 70.1,38.56 v72.85,35.81 | v79.55,35.81 92.96,49.23 v92.96,52.12
N$46  (via drill 0.35)
  Top 0.152: v66.29,45.72 66.29,47.4 IC1.54 | v72.85,40.84 73.76,40.84 76.66,43.74 v78.94,43.74 | v85.04,58.37 91.14,58.37 X1.A12
  Bottom 0.152: v66.29,45.72 66.29,43.89 69.34,40.84 v72.85,40.84 | v78.94,43.74 78.94,52.27 v85.04,58.37
N$47  (via drill 0.35)
  Top 0.152: v65.53,43.74 62.03,47.24 61.57,47.24 61.27,47.55 61.27,48.16 61.57,48.46 63.25,48.46 IC1.47 | v72.08,40.23 73.61,40.23 76.5,43.13 79.25,43.13 v80.16,44.04 | v90.07,58.98 90.37,58.98 91.14,59.74 X1.A13
  Bottom 0.152: v65.53,43.74 65.53,42.22 67.21,40.54 71.78,40.54 v72.08,40.23 | v80.16,44.04 80.16,46.79 88.85,55.47 88.85,57.76 v90.07,58.98
N$48  (via drill 0.35)
  Top 0.152: v61.87,47.85 63.25,47.85 IC1.48 | v60.66,53.34 60.66,56.39 62.94,58.67 65.38,58.67 v67.67,60.96 | X1.A14 v87.63,60.96
  Bottom 0.152: v61.87,47.85 61.87,48.31 60.66,49.53 v60.66,53.34 | v87.63,60.96 v67.67,60.96
N$49  (via drill 0.35)
  Top 0.152: v64.92,45.26 64.77,45.26 63.86,46.18 63.86,47.4 IC1.49 | v72.85,39.62 73.46,39.62 76.35,42.52 v79.4,42.52 | v92.35,61.11 91.29,62.18 X1.A15
  Bottom 0.152: v64.92,45.26 64.92,42.37 67.06,40.23 71.17,40.23 71.78,39.62 v72.85,39.62 | v79.4,42.52 79.4,43.28 79.55,43.43 79.55,46.63 88.54,55.63 88.54,58.37 91.29,61.11 v92.35,61.11
N$50  (via drill 0.35)
  Top 0.152: v66.14,39.62 66.14,41.15 60.05,47.24 60.05,48.01 60.96,48.92 63.25,48.92 IC1.46 | v70.56,39.62 72.85,41.91 73.91,41.91 76.5,44.5 76.5,44.96 81.53,49.99 v81.99,49.99 | v90.07,61.57 90.07,62.48 91.14,63.55 X1.A16
  Bottom 0.152: v66.14,39.62 66.9,39.62 67.21,39.93 70.26,39.93 v70.56,39.62 | v81.99,49.99 81.99,53.49 v90.07,61.57
N$51
  Top 0.152: X1.A1 91.29,44.5 96.62,44.5 X1.B1
N$52
  Top 0.152: X1.A4 91.29,48.31 96.62,48.31 X1.B4
N$53  (via drill 0.35)
  Top 0.152: v64.31,57.3 64.31,56.08 IC1.31 | v93.73,65.99 94.94,64.77 X1.B17
  Bottom 0.152: v64.31,57.3 62.33,59.28 59.44,59.28 47.55,71.17 47.55,71.78 51.05,75.29 84.43,75.29 v93.73,65.99
N$54  (via drill 0.35)
  Top 0.152: v63.4,57.3 63.86,56.84 63.86,56.08 IC1.32 | v63.55,64.16 v62.03,62.64 | v94.64,65.99 96.62,65.99 X1.B18
  Bottom 0.152: v63.4,57.3 64.01,56.69 64.62,56.69 64.92,57 64.92,57.61 62.94,59.59 61.72,59.59 61.42,59.89 61.42,62.03 v62.03,62.64 | v63.55,64.16 86.11,64.16 86.41,64.47 93.12,64.47 v94.64,65.99
N$55  (via drill 0.35)
  Top 0.152: v64.31,52.43 66.29,52.43 66.6,52.73 66.6,53.34 64.92,55.02 63.4,55.02 IC1.34 | v52.12,52.43 52.12,52.73 60.81,61.42 64.01,61.42 65.23,62.64 65.23,62.79 v68.43,65.99 | v92.81,65.99 94.03,67.21 96.62,67.21 X1.B19
  Bottom 0.152: v64.31,52.43 62.48,52.43 62.33,52.58 61.72,52.58 61.42,52.27 61.42,49.23 62.48,48.16 62.48,47.55 62.03,47.09 57.45,47.09 v52.12,52.43 | v92.81,65.99 v68.43,65.99
N$56  (via drill 0.35)
  Top 0.152: v79.55,51.97 72.08,51.97 IC1.9 | v94.94,63.4 96.62,63.4 X1.B16
  Bottom 0.152: v79.55,51.97 90.98,63.4 v94.94,63.4
N$57  (via drill 0.35)
  Top 0.152: v80.47,65.08 71.48,56.08 IC1.17 | v92.35,65.08 92.35,62.03 92.96,61.42 92.96,55.63 92.66,55.32 92.66,53.34 95.1,50.9 96.62,50.9 X1.B6
  Bottom 0.152: v92.35,65.08 v80.47,65.08
N$58  (via drill 0.35)
  Top 0.152: v72.69,56.24 72.08,55.63 IC1.16 | v81.99,56.24 89.61,56.24 v90.07,55.78 | v93.57,53.95 94.79,53.95 96.62,52.12 X1.B7
  Bottom 0.152: v81.99,56.24 v72.69,56.24 | v90.07,55.78 91.9,53.95 v93.57,53.95
N$59  (via drill 0.35)
  Top 0.152: v89.76,72.85 89.76,72.39 72.39,55.02 72.08,55.02 IC1.15 | v97.23,76.2 97.84,75.59 97.84,54.41 96.77,53.34 X1.B8
  Bottom 0.152: v89.76,72.85 93.88,72.85 v97.23,76.2
N$60
  Top 0.152: IC1.14 72.08,54.56 72.39,54.56 90.37,72.54 90.37,75.44 90.53,75.59 92.81,75.59 93.27,75.13 95.56,75.13 96.01,75.59 97.38,75.59 97.54,75.44 97.54,55.32 96.77,54.56 X1.B9
N$61  (via drill 0.35)
  Top 0.152: v63.7,42.67 58.83,47.55 58.83,48.16 61.57,50.9 63.25,50.9 IC1.42 | v65.84,37.34 72.08,37.34 75.74,41 v88.54,41 | v95.56,56.54 96.01,56.54 96.62,55.93 X1.B10
  Bottom 0.152: v63.7,42.67 63.7,39.47 v65.84,37.34 | v88.54,41 97.08,49.53 97.08,57.15 95.86,58.37 95.25,58.37 94.94,58.06 94.94,57.15 v95.56,56.54
N$62  (via drill 0.35)
  Top 0.152: v62.48,40.23 62.48,43.43 58.52,47.4 58.52,48.31 61.42,51.21 62.18,51.21 62.48,51.51 63.25,51.51 IC1.41 | v84.28,34.9 v71.93,34.9 | v95.56,62.18 96.62,62.18 X1.B15
  Bottom 0.152: v62.48,40.23 62.48,37.19 64.77,34.9 v71.93,34.9 | v84.28,34.9 92.05,42.67 92.05,44.04 97.69,49.68 97.69,60.05 v95.56,62.18
N$63  (via drill 0.35)
  Top 0.152: v65.08,53.49 63.4,53.49 IC1.37 | v73.15,46.33 75.29,46.33 81.99,53.03 89.76,53.03 v90.07,52.73 | v93.88,53.03 93.57,53.03 92.96,53.65 92.96,55.17 94.94,57.15 X1.B11
  Bottom 0.152: v65.08,53.49 65.53,53.49 65.68,53.65 67.67,53.65 73.15,48.16 v73.15,46.33 | v90.07,52.73 93.57,52.73 v93.88,53.03
N$64  (via drill 0.35)
  Top 0.152: v65.99,53.03 65.99,53.49 65.38,54.1 63.4,54.1 IC1.36 | v57.3,39.62 63.09,39.62 64.77,37.95 71.78,37.95 72.85,39.01 73.3,39.01 75.59,41.3 82.14,41.3 82.75,41.91 88.54,41.91 v89.76,43.13 | v95.56,57.76 96.01,57.76 96.62,58.37 X1.B12
  Bottom 0.152: v65.99,53.03 65.99,48.77 57.3,40.08 v57.3,39.62 | v89.76,43.13 96.77,50.14 96.77,56.54 v95.56,57.76
N$65  (via drill 0.35)
  Top 0.152: v65.84,62.48 59.13,55.78 59.13,54.71 58.83,54.41 58.83,53.03 59.13,52.73 61.27,52.73 62.33,53.8 62.33,53.95 62.79,54.41 63.25,54.41 IC1.35 | v94.03,64.01 94.03,61.87 96.16,59.74 96.62,59.74 X1.B13
  Bottom 0.152: v65.84,62.48 89.61,62.48 90.98,63.86 93.88,63.86 v94.03,64.01
N$66  (via drill 0.35)
  Top 0.152: v62.48,57.3 63.09,57.91 64.62,57.91 65.38,57.15 65.38,56.08 IC1.29 | v68.28,63.55 v64.31,59.59 | v95.56,61.27 96.32,61.27 96.62,60.96 X1.B14
  Bottom 0.152: v62.48,57.3 63.4,56.39 64.77,56.39 65.23,56.84 65.23,58.67 v64.31,59.59 | v68.28,63.55 85.95,63.55 86.56,64.16 93.27,64.16 93.88,64.77 94.49,64.77 95.56,63.7 95.56,63.09 94.94,62.48 94.94,61.87 v95.56,61.27
N$67
  Top 0.152: X2.A3 3.05,47.09 8.38,47.09 X2.B3
N$68  (via drill 0.35)
  Top 0.152: v73.15,50.44 72.85,50.44 72.39,50.9 72.08,50.9 IC1.7 | v61.72,55.93 v61.72,54.1 | v4.12,50.29 3.81,50.29 3.05,49.53 X2.A5
  Bottom 0.152: v73.15,50.44 72.85,50.44 71.02,52.27 71.02,53.34 70.26,54.1 v61.72,54.1 | v61.72,55.93 61.27,55.93 59.28,57.91 54.25,57.91 48.92,63.25 12.95,63.25 7.62,57.91 4.57,57.91 3.2,56.54 3.2,51.21 v4.12,50.29
N$69  (via drill 0.35)
  Top 0.152: v72.85,51.36 72.69,51.51 72.08,51.51 IC1.8 | v7.32,57.3 7.32,54.41 3.81,50.9 3.05,50.9 X2.A6
  Bottom 0.152: v72.85,51.36 72.85,51.97 69.04,55.78 65.08,55.78 64.31,55.02 60.96,55.02 60.35,55.63 56.08,55.63 48.77,62.94 13.11,62.94 7.47,57.3 v7.32,57.3
N$70  (via drill 0.35)
  Top 0.152: v64.31,48.77 63.7,49.38 63.4,49.38 IC1.45 | v4.12,52.12 3.05,52.12 X2.A7
  Bottom 0.152: v64.31,48.77 64.31,47.55 50.75,33.98 50.75,27.43 48.77,25.45 38.25,25.45 37.95,25.15 37.34,25.15 35.81,26.67 27.74,26.67 20.88,33.53 20.88,35.36 v4.12,52.12
N$71  (via drill 0.35)
  Top 0.152: v62.64,56.24 63.25,55.63 IC1.33 | v7.32,58.52 7.32,58.22 4.72,55.63 4.72,54.56 3.5,53.34 X2.A8
  Bottom 0.152: v62.64,56.24 62.33,56.24 60.35,58.22 54.41,58.22 49.07,63.55 12.34,63.55 v7.32,58.52
N$72  (via drill 0.35)
  Top 0.152: v59.44,47.85 61.57,49.99 63.25,49.99 IC1.44 | v4.27,56.69 3.5,56.69 3.05,57.15 X2.A11 2.9,57.15 2.13,56.39 2.13,55.32 2.29,55.17 2.44,55.17 2.9,54.71 X2.A9
  Bottom 0.152: v59.44,47.85 59.44,51.05 55.93,54.56 26.98,54.56 24.84,56.69 v4.27,56.69
N$73  (via drill 0.35)
  Top 0.152: v74.98,47.85 73.91,47.85 72.54,49.23 72.54,50.29 72.39,50.44 72.08,50.44 IC1.6 | v4.12,54.86 3.05,55.93 X2.A10
  Bottom 0.152: v74.98,47.85 75.74,47.85 78.49,45.11 78.49,44.2 78.33,44.04 78.33,43.13 78.79,42.67 78.79,36.12 57.76,15.09 55.93,15.09 55.32,14.48 55.32,13.72 56.84,12.19 56.84,11.28 54.41,8.84 24.38,8.84 20.88,12.34 20.88,18.29 7.62,31.55 7.62,45.11 4.72,48.01 4.72,50.6 3.5,51.82 3.5,54.25 v4.12,54.86
RXD
  Top 0.152: R10.1 41.76,15.54 39.93,15.54 37.64,13.26 RS232_SERIAL.1
TXD
  Top 0.152: R11.1 37.64,18.44 37.64,15.7 35.2,13.26 RS232_SERIAL.2

### Text on the board
tPlace: SD CARD | USB | UART | Designed by: AKASH SONI
tNames: Microcontroller Board